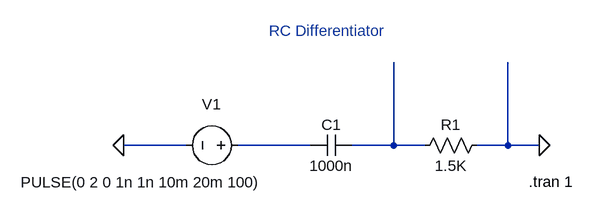
[diagram p0: schematic sch.asc]
sch.asc, the LTspice schematic file:
Version 4
SHEET 1 880 680
WIRE -32 112 -128 112
WIRE 160 112 48 112
WIRE 288 112 288 -16
WIRE 288 112 224 112
WIRE 336 112 288 112
WIRE 464 112 464 -16
WIRE 464 112 416 112
WIRE 512 112 464 112
FLAG -128 112 0
FLAG 512 112 0
SYMBOL cap 224 96 R90
WINDOW 0 0 32 VBottom 2
WINDOW 3 32 32 VTop 2
SYMATTR InstName C1
SYMATTR Value 1000n
SYMBOL res 432 96 R90
WINDOW 0 0 56 VBottom 2
WINDOW 3 32 56 VTop 2
SYMATTR InstName R1
SYMATTR Value 1.5K
SYMBOL voltage 64 112 R90
WINDOW 0 -63 42 VRight 2
WINDOW 3 57 -21 VRight 2
WINDOW 123 0 0 Left 0
WINDOW 39 0 0 Left 0
SYMATTR InstName V1
SYMATTR Value PULSE(0 2 0 1n 1n 10m 20m 100)
TEXT 496 168 Left 2 !.tran 1
TEXT 96 -64 Left 2 ;RC Differentiator

The netlist it stands for:
* sch.asc
C1 N002 N001 1000n
R1 0 N002 1.5K
V1 N001 0 PULSE(0 2 0 1n 1n 10m 20m 100)
.tran 1
* RC Differentiator
.backanno
.end